# Altium project CLS_Project.PrjPcb (part 2 of 2)

## Sheet Antenna.SchDoc: Antenna
size A; Author: Micheal Burin; Revision: 1.0; SheetNumber: 3; SheetTotal: 10
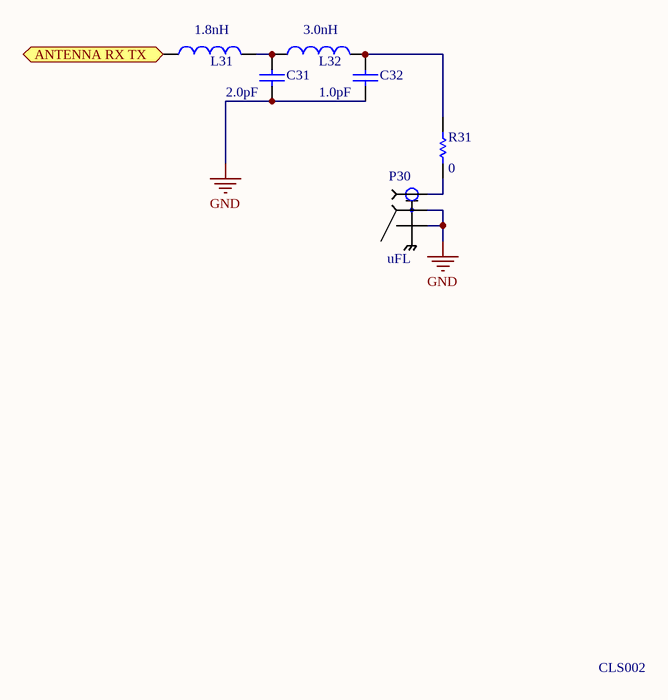
[diagram p9: Antenna.SchDoc]

### Parts
C31  value 2.0pF  [0402_CHIP_FP]  (hidden comment: Capacitor_unpolarized_0805)
C32  value 1.0pF  [0402_CHIP_FP]  (hidden comment: Capacitor_unpolarized_0805)
L31  value 1.8nH  [0402_CHIP_FP]  (hidden comment: Inductor)
L32  value 3.0nH  [0402_CHIP_FP]  (hidden comment: Inductor)
P30  uFL  [MOLEX_1661]
R31  value 0  [0805_CHIP_FP]  (hidden comment: Resistor_0805)

### Ports
ANTENNA RX TX (bidir)

### Nets
GND: C31.1 C32.1 P30.2(GND) P30.3(GND)
NetC31_2: C31.2 L31.2 L32.1
NetC32_2: C32.2 L32.2 R31.2
NetL31_1: L31.1 ; port ANTENNA RX TX
NetP30_1: P30.1(SIG) R31.1

### Notes on the sheet
- CLS002

### Library data of the parts
C31 = Capacitor_unpolarized_0805: Manufacturer: Murata Electronics North America; Manufacturer Part Number: GJM1555C1H2R0WB01D; Vendor Part Number: 490-11205-1-ND; Vendor: Digikey; Vendor Description: CAP CER 2PF 50V C0G/NP0 0402; ComponentLink1Description: Datasheet; ComponentLink1URL: https://www.digikey.com/product-detail/en/murata-electronics-north-america/GJM1555C1H2R0WB01D/490-11205-1-ND/5333045; Cost: .30
C32 = Capacitor_unpolarized_0805: Manufacturer: Murata Electronics North America; Manufacturer Part Number: GJM1555C1H1R0WB01D; Vendor Part Number: 490-11193-1-ND; Vendor: Digikey; Vendor Description: CAP CER 1PF 50V C0G/NP0 0402; ComponentLink1Description: Datasheet; ComponentLink1URL: https://www.digikey.com/product-detail/en/murata-electronics-north-america/GJM1555C1H1R0WB01D/490-11193-1-ND/5333033; Cost: .30
L31 = Inductor: Manufacturer: Murata Electronics North America; Manufacturer Part Number: LQP15MN1N8B02D; Vendor Part Number: 490-1127-1-ND; Vendor: Digikey; Vendor Description: FIXED IND 1.8NH 280MA 200 MOHM; ComponentLink1Description: Datasheet; ComponentLink1URL: https://www.digikey.com/product-detail/en/murata-electronics-north-america/LQP15MN1N8B02D/490-1127-1-ND/584573; Cost: .19
L32 = Inductor: Manufacturer: Murata Electronics North America; Manufacturer Part Number: LQP15MN3N0B02D; Vendor Part Number: 490-6755-1-ND; Vendor: Digikey; Vendor Description: FIXED IND 3NH 190MA 400 MOHM SMD; ComponentLink1Description: Datasheet; ComponentLink1URL: https://www.digikey.com/product-detail/en/murata-electronics-north-america/LQP15MN3N0B02D/490-6755-1-ND/3845952; Cost: .19
P30 = 1661: uFL SMT Antenna Connector; Manufacturer: Hirose Electric Co Ltd; Manufacturer Part Number: U.FL-R-SMT-1(10); Vendor Part Number: H11891CT-ND; MF: Keystone Electronics; Vendor: Digikey; Vendor Description: CONN U.FL RCPT STR 50 OHM SMD; Package: None; MP: 1661; SnapEDA_Link: https://www.snapeda.com/parts/1661/Keystone%20Electronics/view-part/?ref=snap; Price: None; Availability: Unavailable; Value: *; ComponentLink1Description: Datasheet; ComponentLink1URL: https://www.digikey.com/products/en/connectors-interconnects/coaxial-connectors-rf/437?k=U.FL-R-SMT-1%2810%29&k=&pkeyword=U.FL-R-SMT-1%2810%29&pv7=2&sf=0&FV=ffe001b5&quantity=&ColumnSort=0&page=1&stock=1&datasheet=1&cad=1&rohs=1&pageSize=25; Cost: 1.31
R31 = Resistor_0805: Manufacturer: Vishay Dale; Manufacturer Part Number: CRCW08050000Z0EA; Vendor Part Number: 541-0.0ACT-ND; Vendor: Digikey; Vendor Description: RES SMD 0 OHM JUMPER 1/8W 0805; ComponentLink1Description: Datasheet; ComponentLink1URL: https://www.digikey.com/product-detail/en/vishay-dale/CRCW08050000Z0EA/541-0.0ACT-ND/1180267; Cost: .04

## Nets that join several sheets
GND: Top (TP10.1 TP14.1 TP20.1), MCU (24 pins), Accelerometer (7 pins), GPS (C90.2 U90.2 U91.7), Programmer (G95.17 J95.1), IO (6 pins), RFRX (23 pins), ESS (21 pins), Reset (R85.1 U85.3 Z85.2), Antenna (C31.1 C32.1 P30.2 P30.3)
VCC_3.3: Top (R45.2 R46.2), MCU (17 pins), Accelerometer (5 pins), GPS (C90.1 U90.4 U90.5), Programmer (G95.1 G95.16 J95.5), IO (R71.2), ESS (P52.2 TP51.1), Reset (U85.2)
ACC_~{CS}: Top (TP17.1), MCU (U33.33), Accelerometer (U80.7)
ACC_INT1: Top (TP18.1), MCU (U33.32), Accelerometer (U80.8)
ACC_INT2: Top (TP19.1), MCU (U33.31), Accelerometer (U80.9)
ACC_SCL: Top (R46.1 TP16.1), MCU (U33.29), Accelerometer (U80.14)
ACC_SDA: Top (R45.1 TP15.1), MCU (U33.30), Accelerometer (U80.13)
DBG_SWCLK: MCU (U33.1), Programmer (G95.9 J95.2)
DBG_SWDIO: MCU (U33.2), Programmer (G95.7 J95.3)
DBG_SWO: MCU (U33.3), Programmer (G95.13 J95.4)
GPS_PWR_ON: Top (TP13.1), MCU (U33.24)
GPS_RX: Top (TP12.1), MCU (U33.26), GPS (U91.3)
GPS_TX: Top (TP11.1), MCU (U33.25), GPS (U91.4)
NetC70_2: Top (TP3.1), MCU (U33.22), IO (5 pins)
NetG95_15: Top (TP21.1), MCU (U33.12), Programmer (G95.15 J95.6), Reset (S85.1 S85.3 U85.1)
NetJU70_1: MCU (U33.19), IO (JU70.1)
NetJU71_1: MCU (U33.20), IO (JU71.1)
NetJU72_1: MCU (U33.21), IO (JU72.1)
NetL31_1: MCU (U33.17), Antenna (L31.1)
NetTP0_1: Top (TP0.1), MCU (U33.23)
NetTP1_1: Top (TP1.1), MCU (U33.7)
NetTP2_1: Top (TP2.1), MCU (U33.6)
SPI_~{CS}: Top (TP7.1), MCU (U33.46), RFRX (JU_PORTS2.3)
SPI_CLK: Top (TP8.1), MCU (U33.44), RFRX (JU_PORTS2.5)
SPI_PWR_ON: Top (TP9.1), MCU (U33.48), RFRX (JU_PORTS2.1)
SPI_RX: Top (TP5.1), MCU (U33.47), RFRX (JU_PORTS2.2)
SPI_RX2: Top (TP4.1), MCU (U33.43), RFRX (JU_PORTS2.6)
SPI_TX: Top (TP6.1), MCU (U33.45), RFRX (JU_PORTS2.4)